# EAGLE schematic Temperature Sensor Rev.3 (EAGLE 7.6.0)
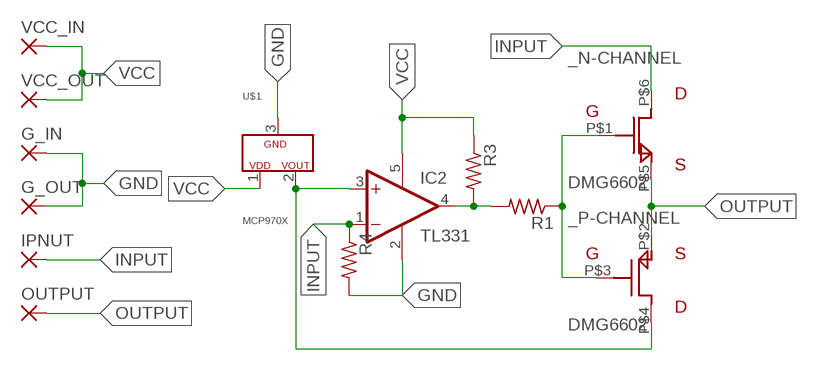
[diagram p0: schematic, sheet 1]

## Parts
_  DMG6602  [SOT23-6]
G_IN  1,6/0,8  [1,6/0,8]
G_OUT  1,6/0,8  [1,6/0,8]
IC2  TL331  [DBV-R-PDSO-G5]
IPNUT  1,6/0,8  [1,6/0,8]
OUTPUT  1,6/0,8  [1,6/0,8]
R1  R-US_R0603  [R0603]
R3  R-US_R0603  [R0603]
R4  R-US_R0603  [R0603]
U$1  MCP970X  [SOT23]
VCC_IN  1,6/0,8  [1,6/0,8]
VCC_OUT  1,6/0,8  [1,6/0,8]

## Nets
COMP_OUT: IC2.4(OUT) R1.2 R3.2
GND: G_IN.1(P) G_OUT.1(P) IC2.2(GND) R4.2 U$1.3(GND)
INPUT: _.P$6(N-CHANNEL:D$1) IC2.1(-IN) IPNUT.1(P) R4.1
MOS_IN: _.P$1(N-CHANNEL:G$1) _.P$3(P-CHANNEL:G$1) R1.1
OUTPUT: _.P$2(P-CHANNEL:S$1) _.P$5(N-CHANNEL:S$1) OUTPUT.1(P)
THERM_OUT: _.P$4(P-CHANNEL:D$1) IC2.3(+IN) U$1.2(VOUT)
VCC: IC2.5(V+) R3.1 U$1.1(VDD) VCC_IN.1(P) VCC_OUT.1(P)

## Library data of the parts
_ = formula electric:DMG6602: N and P Channel Mosfet
G_IN G_OUT IPNUT OUTPUT VCC_IN VCC_OUT = wirepad:1,6/0,8: THROUGH-HOLE PAD
IC2 = linear:TL331: SINGLE DIFFERENTIAL COMPARATOR Source: Data sheet <http://www.ti.com/lit/ds/symlink/tl331-q1.pdf>
R1 R3 R4 = resistor:R-US_: RESISTOR, American symbol
U$1 = microchip:MCP970X: Temperature Sensor IC